# Altium schematic sheet S01.SchDoc: DQLA-Q  Dual QLA Interface Board
size 381 x 254 mm; Revision: 1.1; SheetNumber: 1; SheetTotal: 3
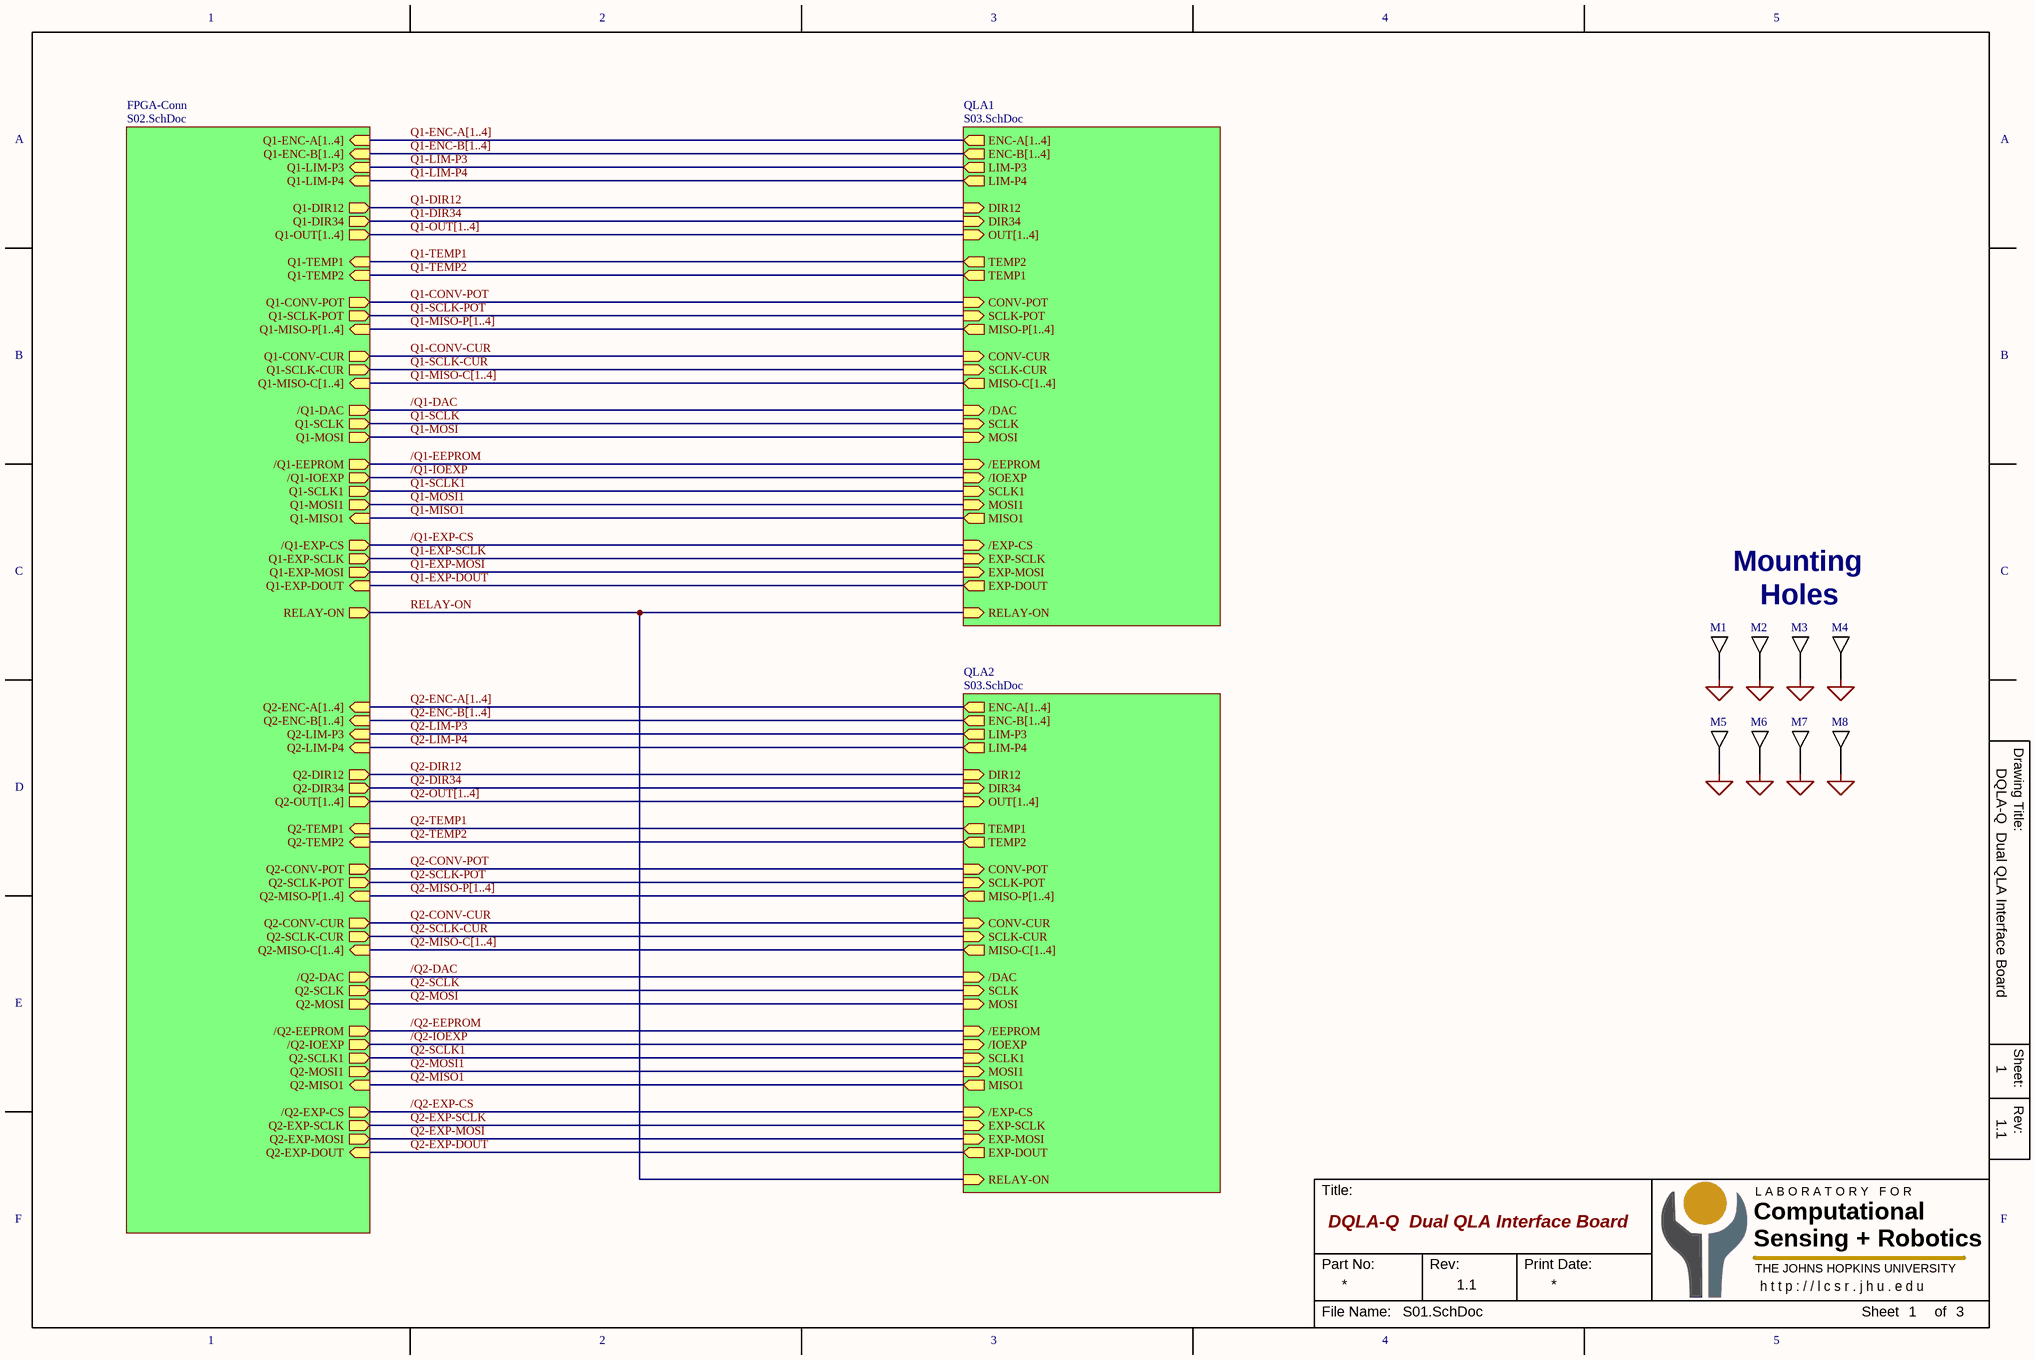
[diagram p0: S01.SchDoc]

## Parts
M1  MHOLE  [MHOLE4]  (value not drawn)  (no BOM)
M2  MHOLE  [MHOLE4]  (value not drawn)  (no BOM)
M3  MHOLE  [MHOLE4]  (value not drawn)  (no BOM)
M4  MHOLE  [MHOLE4]  (value not drawn)  (no BOM)
M5  MHOLE  [MHOLE4]  (value not drawn)  (no BOM)
M6  MHOLE  [MHOLE4]  (value not drawn)  (no BOM)
M7  MHOLE  [MHOLE4]  (value not drawn)  (no BOM)
M8  MHOLE  [MHOLE4]  (value not drawn)  (no BOM)

## Sub-sheets
FPGA-Conn = S02.SchDoc: Q2-DIR34 (out), Q1-CONV-CUR (out), /Q1-EXP-CS (out), /Q2-EXP-CS (out), Q2-LIM-P4 (in), Q1-DIR12 (out), Q1-LIM-P4 (in), Q1-SCLK-CUR (out), Q1-DIR34 (out), Q2-EXP-DOUT (in), Q1-MOSI1 (out), RELAY-ON (out), Q1-CONV-POT (out), Q1-SCLK-POT (out), Q2-DIR12 (out), Q2-OUT[1..4] (out), Q2-LIM-P3 (in), /Q1-DAC (out), Q1-MISO-P[1..4] (in), Q2-MISO-P[1..4] (in), Q1-LIM-P3 (in), Q1-TEMP2 (in), /Q1-IOEXP (out), /Q1-EEPROM (out), Q2-TEMP2 (in), Q2-TEMP1 (in), /Q2-DAC (out), /Q2-IOEXP (out), Q2-ENC-A[1..4] (in), Q1-MOSI (out), Q1-OUT[1..4] (out), Q1-MISO-C[1..4] (in), /Q2-EEPROM (out), Q2-MISO-C[1..4] (in), Q2-ENC-B[1..4] (in), Q1-ENC-B[1..4] (in), Q2-MOSI (out), Q1-EXP-DOUT (in), Q1-ENC-A[1..4] (in), Q1-TEMP1 (in), Q1-SCLK (out), Q2-CONV-POT (out), Q2-CONV-CUR (out), Q2-SCLK-CUR (out), Q2-SCLK-POT (out), Q2-MOSI1 (out), Q2-SCLK (out), Q2-SCLK1 (out), Q1-SCLK1 (out), Q2-MISO1 (in), Q1-MISO1 (in), Q1-EXP-SCLK (out), Q1-EXP-MOSI (out), Q2-EXP-SCLK (out), Q2-EXP-MOSI (out)
QLA1 = S03.SchDoc: ENC-A[1..4] (out), SCLK-POT (in), RELAY-ON (in), OUT[1..4] (in), EXP-DOUT (out), LIM-P3 (out), CONV-POT (in), ENC-B[1..4] (out), TEMP2 (out), TEMP1 (out), DIR12 (in), SCLK (in), MISO-P[1..4] (out), /EXP-CS (in), MOSI1 (in), EXP-MOSI (in), EXP-SCLK (in), /IOEXP (in), /EEPROM (in), SCLK1 (in), MISO1 (out), LIM-P4 (out), /DAC (in), DIR34 (in), CONV-CUR (in), SCLK-CUR (in), MOSI (in), MISO-C[1..4] (out)
QLA2 = S03.SchDoc: ENC-A[1..4] (out), SCLK-POT (in), RELAY-ON (in), OUT[1..4] (in), EXP-DOUT (out), LIM-P3 (out), CONV-POT (in), ENC-B[1..4] (out), TEMP2 (out), TEMP1 (out), DIR12 (in), SCLK (in), MISO-P[1..4] (out), /EXP-CS (in), MOSI1 (in), EXP-MOSI (in), EXP-SCLK (in), /IOEXP (in), /EEPROM (in), SCLK1 (in), MISO1 (out), LIM-P4 (out), /DAC (in), DIR34 (in), CONV-CUR (in), SCLK-CUR (in), MOSI (in), MISO-C[1..4] (out)

## Nets
GND: M1.1 M2.1 M3.1 M4.1 M5.1 M6.1 M7.1 M8.1
/Q1-DAC: sheet FPGA-Conn//Q1-DAC, sheet QLA1//DAC
/Q1-EEPROM: sheet FPGA-Conn//Q1-EEPROM, sheet QLA1//EEPROM
/Q1-EXP-CS: sheet FPGA-Conn//Q1-EXP-CS, sheet QLA1//EXP-CS
/Q1-IOEXP: sheet FPGA-Conn//Q1-IOEXP, sheet QLA1//IOEXP
/Q2-DAC: sheet FPGA-Conn//Q2-DAC, sheet QLA2//DAC
/Q2-EEPROM: sheet FPGA-Conn//Q2-EEPROM, sheet QLA2//EEPROM
/Q2-EXP-CS: sheet FPGA-Conn//Q2-EXP-CS, sheet QLA2//EXP-CS
/Q2-IOEXP: sheet FPGA-Conn//Q2-IOEXP, sheet QLA2//IOEXP
Q1-CONV-CUR: sheet FPGA-Conn/Q1-CONV-CUR, sheet QLA1/CONV-CUR
Q1-CONV-POT: sheet FPGA-Conn/Q1-CONV-POT, sheet QLA1/CONV-POT
Q1-DIR12: sheet FPGA-Conn/Q1-DIR12, sheet QLA1/DIR12
Q1-DIR34: sheet FPGA-Conn/Q1-DIR34, sheet QLA1/DIR34
Q1-EXP-DOUT: sheet FPGA-Conn/Q1-EXP-DOUT, sheet QLA1/EXP-DOUT
Q1-EXP-MOSI: sheet FPGA-Conn/Q1-EXP-MOSI, sheet QLA1/EXP-MOSI
Q1-EXP-SCLK: sheet FPGA-Conn/Q1-EXP-SCLK, sheet QLA1/EXP-SCLK
Q1-LIM-P3: sheet FPGA-Conn/Q1-LIM-P3, sheet QLA1/LIM-P3
Q1-LIM-P4: sheet FPGA-Conn/Q1-LIM-P4, sheet QLA1/LIM-P4
Q1-MISO1: sheet FPGA-Conn/Q1-MISO1, sheet QLA1/MISO1
Q1-MOSI: sheet FPGA-Conn/Q1-MOSI, sheet QLA1/MOSI
Q1-MOSI1: sheet FPGA-Conn/Q1-MOSI1, sheet QLA1/MOSI1
Q1-SCLK: sheet FPGA-Conn/Q1-SCLK, sheet QLA1/SCLK
Q1-SCLK1: sheet FPGA-Conn/Q1-SCLK1, sheet QLA1/SCLK1
Q1-SCLK-CUR: sheet FPGA-Conn/Q1-SCLK-CUR, sheet QLA1/SCLK-CUR
Q1-SCLK-POT: sheet FPGA-Conn/Q1-SCLK-POT, sheet QLA1/SCLK-POT
Q1-TEMP1: sheet FPGA-Conn/Q1-TEMP1, sheet QLA1/TEMP2
Q1-TEMP2: sheet FPGA-Conn/Q1-TEMP2, sheet QLA1/TEMP1
Q2-CONV-CUR: sheet FPGA-Conn/Q2-CONV-CUR, sheet QLA2/CONV-CUR
Q2-CONV-POT: sheet FPGA-Conn/Q2-CONV-POT, sheet QLA2/CONV-POT
Q2-DIR12: sheet FPGA-Conn/Q2-DIR12, sheet QLA2/DIR12
Q2-DIR34: sheet FPGA-Conn/Q2-DIR34, sheet QLA2/DIR34
Q2-EXP-DOUT: sheet FPGA-Conn/Q2-EXP-DOUT, sheet QLA2/EXP-DOUT
Q2-EXP-MOSI: sheet FPGA-Conn/Q2-EXP-MOSI, sheet QLA2/EXP-MOSI
Q2-EXP-SCLK: sheet FPGA-Conn/Q2-EXP-SCLK, sheet QLA2/EXP-SCLK
Q2-LIM-P3: sheet FPGA-Conn/Q2-LIM-P3, sheet QLA2/LIM-P3
Q2-LIM-P4: sheet FPGA-Conn/Q2-LIM-P4, sheet QLA2/LIM-P4
Q2-MISO1: sheet FPGA-Conn/Q2-MISO1, sheet QLA2/MISO1
Q2-MOSI: sheet FPGA-Conn/Q2-MOSI, sheet QLA2/MOSI
Q2-MOSI1: sheet FPGA-Conn/Q2-MOSI1, sheet QLA2/MOSI1
Q2-SCLK: sheet FPGA-Conn/Q2-SCLK, sheet QLA2/SCLK
Q2-SCLK1: sheet FPGA-Conn/Q2-SCLK1, sheet QLA2/SCLK1
Q2-SCLK-CUR: sheet FPGA-Conn/Q2-SCLK-CUR, sheet QLA2/SCLK-CUR
Q2-SCLK-POT: sheet FPGA-Conn/Q2-SCLK-POT, sheet QLA2/SCLK-POT
Q2-TEMP1: sheet FPGA-Conn/Q2-TEMP1, sheet QLA2/TEMP1
Q2-TEMP2: sheet FPGA-Conn/Q2-TEMP2, sheet QLA2/TEMP2
RELAY-ON: sheet FPGA-Conn/RELAY-ON, sheet QLA1/RELAY-ON, sheet QLA2/RELAY-ON

## Buses and harness runs
bus Q1-ENC-A[1..4] = sheet FPGA-Conn/Q1-ENC-A[1..4] = sheet QLA1/ENC-A[1..4]
bus Q1-ENC-B[1..4] = sheet FPGA-Conn/Q1-ENC-B[1..4] = sheet QLA1/ENC-B[1..4]
bus Q1-MISO-C[1..4] = sheet FPGA-Conn/Q1-MISO-C[1..4] = sheet QLA1/MISO-C[1..4]
bus Q1-MISO-P[1..4] = sheet FPGA-Conn/Q1-MISO-P[1..4] = sheet QLA1/MISO-P[1..4]
bus Q1-OUT[1..4] = sheet FPGA-Conn/Q1-OUT[1..4] = sheet QLA1/OUT[1..4]
bus Q2-ENC-A[1..4] = sheet FPGA-Conn/Q2-ENC-A[1..4] = sheet QLA2/ENC-A[1..4]
bus Q2-ENC-B[1..4] = sheet FPGA-Conn/Q2-ENC-B[1..4] = sheet QLA2/ENC-B[1..4]
bus Q2-MISO-C[1..4] = sheet FPGA-Conn/Q2-MISO-C[1..4] = sheet QLA2/MISO-C[1..4]
bus Q2-MISO-P[1..4] = sheet FPGA-Conn/Q2-MISO-P[1..4] = sheet QLA2/MISO-P[1..4]
bus Q2-OUT[1..4] = sheet FPGA-Conn/Q2-OUT[1..4] = sheet QLA2/OUT[1..4]

## Notes on the sheet
- To do:
- Mounting
- Holes
- 1
- 2
- 3
- 4
- 5
- A
- B
- C
- Drawing Title:
- D
- E
- Sheet:
- Rev:
- F
- Title:
- Computational
- Sensing + Robotics
- L A B O R A T O R Y   F O R
- Part No:
- Print Date:
- THE JOHNS HOPKINS UNIVERSITY
- h t t p : / / l c s r . j h u . e d u
- File Name:
- Sheet
- of

## Library data of the parts
M1-M8 = MHOLE: Mounting Hole